# EAGLE design ADC2PWM (EAGLE 9.6.2)
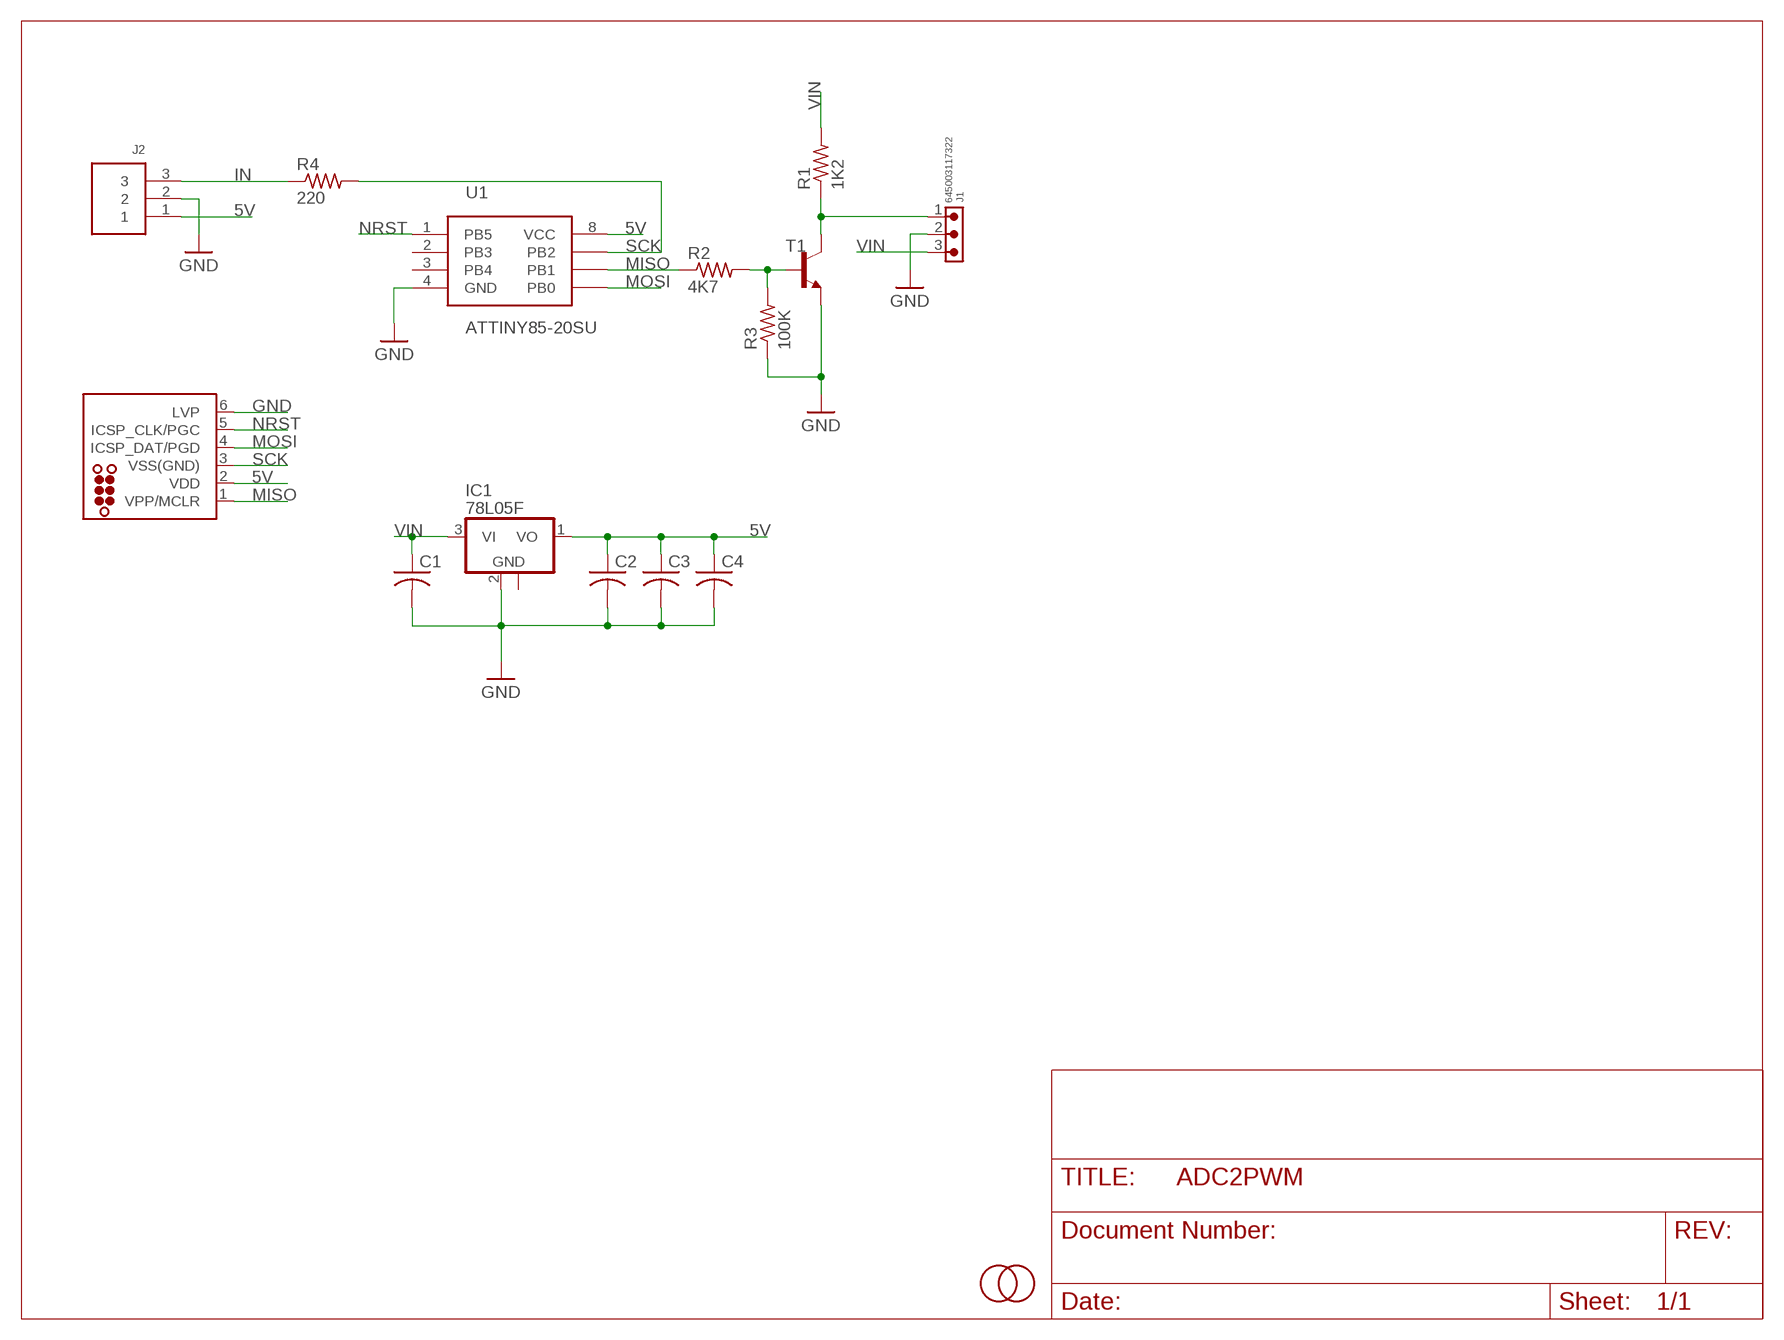
[diagram p0: schematic, sheet 1]

## Parts
C1  C-USC0603  [C0603]
C2  C-USC0603  [C0603]
C3  C-USC0603  [C0603]
C4  C-USC0603  [C0603]
IC1  78L05F  [SOT89]
J1  645003117322  [645003117322]
J2  3PIN  [B3B-PH-K-S]
J3  TC2030-MCP-NL  [TC2030-MCP-NL]
R1  1K2  R-US_R0603  [R0603]
R2  4K7  R-US_R0603  [R0603]
R3  100K  R-US_R0603  [R0603]
R4  220  R-US_R0603  [R0603]
T1  MMBT2222ALT1-NPN-SOT23-BEC  [SOT23-BEC]
U1  ATTINY85-20SU  [SOIC-8]
U$1  FIDUCIAL  [FIDUCIAL_1MM]
U$2  FIDUCIAL  [FIDUCIAL_1MM]

## Nets
5V: C2.1 C3.1 C4.1 IC1.1(VO) J2.1 J3.2(VDD) U1.8(VCC)
GND: C1.2 C2.2 C3.2 C4.2 IC1.2(GND) J1.2 J2.2 J3.6(LVP) R3.1 T1.E U1.4(GND)
IN: J2.3 R4.1
MISO: J3.1(VPP/MCLR) R2.1 U1.6(PB1)
MOSI: J3.4(ICSP_DAT/PGD) U1.5(PB0)
N$1: J1.1 R1.1 T1.C
N$4: R2.2 R3.2 T1.B
NRST: J3.5(ICSP_CLK/PGC) U1.1(PB5)
SCK: J3.3(VSS(GND)) R4.2 U1.7(PB2)
VIN: C1.1 IC1.3(VI) J1.3 R1.2
Unconnected: IC1.2@1(GND) U1.2(PB3) U1.3(PB4)

## Library data of the parts
C1-C4 = rcl:C-US: CAPACITOR, American symbol; SPICEPREFIX: C
IC1 = linear:78L*: POSITOIV-VOLTAGE REGULATORS Output up to 100 mA Source: Datasheet <http://focus.ti.com/lit/ds/symlink/ua78l05.pdf>
J1 = Wurth_Connectors_WR-WTB:645003117322: WR-WTB 3.96 mm Male Right Angled Locking Header KIND PROPERTIES: Pitch:3.96mm Gender:Male MATERIAL PROPERTIES: Insulator Material :PA66 Insulator Flammability Rating:UL94 V-2 Color:White Contact Material:Copper Alloy Contact Plating:Tin Contact Type:Stamped GENERAL INFORMATION Operating Temperature:-40 up to +105 °C Compliance: RoHS Working Voltage:250 V (AC) Withstanding Voltage:1500 V (AC) Contact Resistance:20 mΩ RISO:1000 MΩ CERTIFICATION UL Approval:E323964 PACKAGING PROPERTIES Packaging:Bag <https://katalog.we-online.com/media/images/v2/o61038v209%20Family_Con_WTB_3.96_PCB_THT_6450xx117322_pf2.jpg> Details see: https://katalog.we-online.com/en/em/WTB_3_96_MALE_RIGHT_ANGLED_LOCKING_HEADER_6450XX117322 Updated by Yingchun,Shan 2019-11-05 2019 (C) Würth Elektronik; CONTACT-RESISTANCE: 20mOhm; DATASHEET-URL: https://www.we-online.com/redexpert/spec/645003117322?ae; GENDER: Male; IR: 7A; L: 11.88mm; MOUNT: THT; PACKAGING: Bag; PART-NUMBER: 645003117322; PCB-CABLE-PANEL: PCB; PINS: 3; PITCH: 3.96mm; TYPE: Right Angled; WORKING-VOLTAGE: 250V(AC)
J2 = jst_eph:3PIN
J3 = tag-connect:TC2030: TAG-CONNECT ICSP Connector Manufacturer: Tag-Connect <http://www.tag-connect.com> Cable for easy In-Circuit Serial Programming. Designed for Microchip ICD2, suitable for many others. Two variants - one "with legs" (for hands-free fit on PCB) and another "without legs" for quick programming. PAD Description 1 MCLR/Vpp 2 Vdd 3 GND 4 PGD (ISPDAT) 5 PGC (ISPCLK) 6 nc (used for LVP) ©2009 ROFA.cz - modified and updated by Robert Darlington ‹rdarlington@gmail.com›
R1-R4 = rcl:R-US_: RESISTOR, American symbol; SPICEPREFIX: R
T1 = transistor:*-NPN-: NPN Transistror BF959 corrected 2008.03.06
U1 = Microcontroller:ATTINY85-20SU: IC MCU 8BIT 8KB FLASH 8SOIC Manufacturer's datasheet <http://ww1.microchip.com/downloads/en/DeviceDoc/Atmel-2586-AVR-8-bit-Microcontroller-ATtiny25-ATtiny45-ATtiny85_Datasheet-Summary.pdf>; CREATED_BY: PCBLayout.com; DIGI_KEY_PART_NUMBER: ATTINY85-20SU-ND; MANUFACTURER: Microchip Technology; MPN: ATTINY85-20SU; PACKAGE: 8-SOIC
U$1 U$2 = adafruit:FIDUCIAL: For use by pick and place machines to calibrate the vision/machine, 1mm By microbuilder.eu

## Board
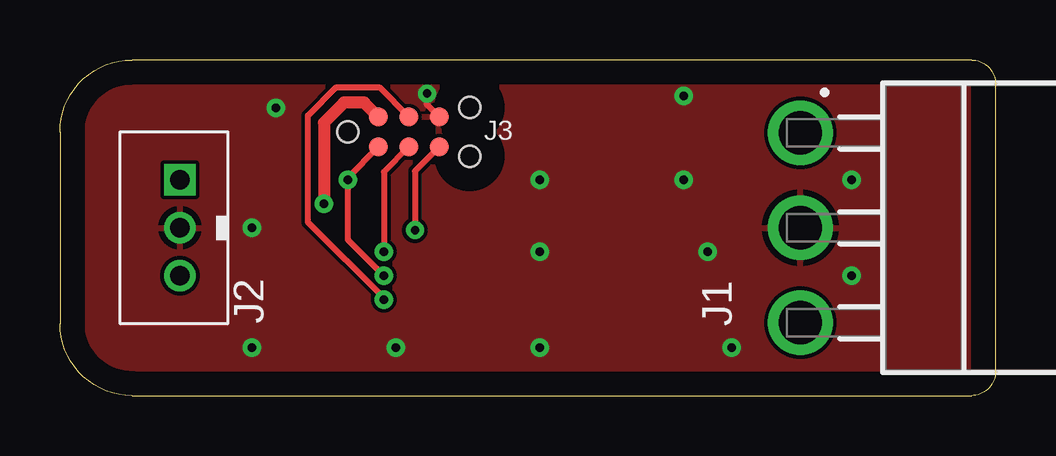
[diagram p1: board, top side]
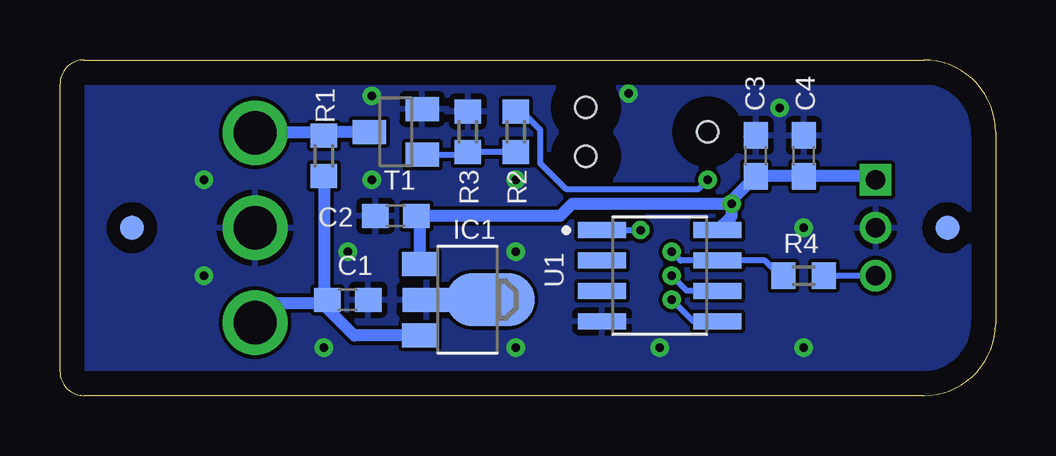
[diagram p2: board, bottom side, seen from below]

Size 39 x 14 mm. Coordinates in mm from the lower left corner, seen from the top.
Outline: 3,0 38,0 arc90 39,1 39,13 arc90 38,14 3,14 arc90 0,11 0,3 arc90 3,0
Copper layers (1*16): Top 0.035mm / dielectric 1.5mm / Bottom 0.035mm
Design rules "default *": minimum track width 6mil, minimum drill 0.35mm, track to track 6mil, track to pad 6mil, pad to pad 6mil, via to via 6mil, smd to smd 6mil, copper to edge 40mil, drill to drill 6mil, minimum pad ring 10mil, minimum via ring 8mil, stop-mask expansion 4mil, vias tented up to drill 100mil, thermal gap 10mil

### Footprints (pad centres in the part's own frame; a part is rotated, then mirrored left to right if it is on the bottom)
C0603 = smd 1.1 x 1: 1 -0.85,0; 2 0.85,0
SOT89 = smd 1 x 1.5: 1 -1.499,-1.981; 3 1.499,-1.981 | smd 1 x 2: 2 0,-1.727 | smd 2.2 x 3.7: 2@1 0,0.94
645003117322 = drill 1.8: 1 3.96,5.13; 2 0,5.13; 3 -3.96,5.13
B3B-PH-K-S = drill 0.813 square: 1 2,0 | drill 0.813: 2 0,0; 3 -2,0
TC2030-MCP-NL = smd 0.787 x 0.787: 1 1.27,-0.635; 2 1.27,0.635; 3 2.54,-0.635; 4 2.54,0.635; 5 3.81,-0.635; 6 3.81,0.635 | hole 0.889: 0,0; 5.08,-1.016; 5.08,1.016
R0603 = smd 1 x 1.1: 1 -0.85,0; 2 0.85,0
SOT23-BEC = smd 1 x 1.4: B -0.95,-1.1; C 0,1.1; E 0.95,-1.1
SOIC-8 = smd 2 x 0.66: 1 -2.405,1.905; 2 -2.405,0.635; 3 -2.405,-0.635; 4 -2.405,-1.905; 5 2.405,-1.905; 6 2.405,-0.635; 7 2.405,0.635; 8 2.405,1.905
FIDUCIAL_1MM = smd 1 x 1: 1 0,0

### Placement (x,y rotation side)
C1  27,4 0 bottom
C2  25,7.5 180 bottom
C3  10,10 90 bottom
C4  8,10 90 bottom
IC1  22,4 270 bottom
J1  36,7 90 top
J2  5,7 90 top
J3  12,11 0 top
R1  28,10 270 bottom
R2  20,11 270 bottom
R3  22,11 270 bottom
R4  8,5 180 bottom
T1  25,11 90 bottom
U1  14,5 0 bottom
U$1  36,7 0 bottom
U$2  2,7 0 bottom

### Tracks (layer width: path | path; a pad name or v marks a point on that pad's centre or on a via)
5V  (via drill 0.35)
  Top 0.508: J3.2 12.69,12.22 11.84,12.22 11,11.38 v11,8
  Bottom 0.508: J2.1 5.15,9.15 C4.1 C3.1 11,8.15 v11,8 | U1.8 11,7.5 v11,8 | v11,8 17.65,8 18.15,7.5 C2.1 23.98,7.33 IC1.1
GND  (via drill 0.35)
  Top 0.254: J3.6 15.3,12.14 v15.3,12.6
  other vias: 9,12 26,12.5 26,9 27,6 33,9 33,5 28,2 20,6 20,2 14,2 20,9 8,2 8,7
  pour Top: 0,14 40,14 40,0 0,0
  pour Bottom: 0,14 40,14 40,0 0,0
IN
  Bottom 0.254: J2.3 R4.1
MISO  (via drill 0.35)
  Top 0.254: J3.1 12,9.1 v12,9 12,6.5 v13.5,5
  Bottom 0.254: U1.6 12.87,4.37 v13.5,5 | v12,9 12.38,8.62 17.91,8.62 18.98,9.69 18.98,11.09 19.75,11.85 R2.1
MOSI  (via drill 0.35)
  Top 0.254: v13.5,4 13.5,4.07 10.34,7.23 10.34,11.69 11.51,12.86 13.32,12.86 J3.4
  Bottom 0.254: U1.5 12.6,3.1 v13.5,4
N$1
  Bottom 0.508: T1.C 27.85,11 R1.1 28.11,10.96 J1.1
N$4
  Bottom 0.254: R2.2 21.59,10.15 | 21.59,10.15 R3.2 | T1.B 21.69,10.05 21.59,10.15
NRST  (via drill 0.35)
  Top 0.254: J3.5 14.8,9.36 v14.8,6.9
  Bottom 0.254: U1.1 v14.8,6.9
SCK  (via drill 0.35)
  Top 0.254: J3.3 13.5,9.32 v13.5,6
  Bottom 0.254: R4.2 8.98,5 9.61,5.63 U1.7 13.13,5.63 v13.5,6
VIN
  Bottom 0.508: IC1.3 26.73,2.5 27.85,3.62 C1.1 | J1.3 30.04,3.87 27.98,3.87 C1.1 | R1.2 28,4.15 C1.1

### Text on the board
tStop: ADC2PWM ©Vas